# EAGLE design SeismoSpiesPCB (EAGLE 9.6.2)

## Sheet 1 of 2
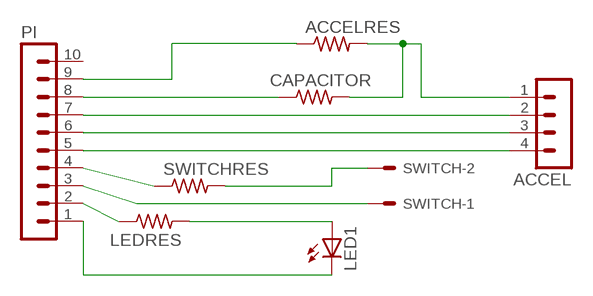
[diagram p0: schematic, sheet 1]

### Parts
ACCEL  04_PIN-HEADER  [MA04-1]
ACCELRES  4.7 K  RESISTOR0204/7  [RESISTOR]
CAPACITOR  RESISTOR0204/7  [RESISTOR]
LED1  LED3MM  [LED3MM]
LEDRES  RESISTOR0204/7  [RESISTOR]
PI  10_PIN-HEADER-(FROM_ARDUINO)  [MA10-1]
SWITCH  02_PIN-HEADER  [02_PIN]
SWITCHRES  RESISTOR0204/7  [RESISTOR]

### Nets
N$1: ACCEL.4 PI.5
N$2: PI.4 SWITCHRES.1
N$3: SWITCH.2 SWITCHRES.2
N$4: PI.3 SWITCH.1
N$5: LEDRES.1 PI.2
N$6: ACCEL.1 ACCELRES.2 CAPACITOR.2
N$7: ACCEL.3 PI.6
N$8: ACCELRES.1 PI.9
N$9: CAPACITOR.1 PI.8
N$10: ACCEL.2 PI.7
N$11: LED1.A LEDRES.2
N$12: LED1.K(C) PI.1
Unconnected: PI.10

## Sheet 2 of 2

## Library data of the parts
ACCEL = 1stYearEngineering:04_PIN-HEADER: PIN HEADER; OC_FARNELL: unknown; OC_NEWARK: unknown
ACCELRES CAPACITOR LEDRES SWITCHRES = 1stYearEngineering:RESISTOR: RESISTOR, American symbol
LED1 = 1stYearEngineering:LED: LED OSRAM: - CHIPLED LG R971, LG N971, LY N971, LG Q971, LY Q971, LO R971, LY R971 LH N974, LH R974 LS Q976, LO Q976, LY Q976 LO Q996 - Hyper CHIPLED LW Q18S LB Q993, LB Q99A, LB R99A - SideLED LS A670, LO A670, LY A670, LG A670, LP A670 LB A673, LV A673, LT A673, LW A673 LH A674 LY A675 LS A676, LA A676, LO A676, LY A676, LW A676 LS A679, LY A679, LG A679 - Hyper Micro SIDELED® LS Y876, LA Y876, LO Y876, LY Y876 LT Y87S - SmartLED LW L88C, LW L88S LB L89C, LB L89S, LG L890 LS L89K, LO L89K, LY L89K LS L896, LA L896, LO L896, LY L896 - TOPLED LS T670, LO T670, LY T670, LG T670, LP T670 LSG T670, LSP T670, LSY T670, LOP T670, LYG T670 LG T671, LOG T671, LSG T671 LB T673, LV T673, LT T673, LW T673 LH T674 LS T676, LA T676, LO T676, LY T676, LB T676, LH T676, LSB T676, LW T676 LB T67C, LV T67C, LT T67C, LS T67K, LO T67K, LY T67K, LW E67C LS E67B, LA E67B, LO E67B, LY E67B, LB E67C, LV E67C, LT E67C LW T67C LS T679, LY T679, LG T679 LS T770, LO T770, LY T770, LG T770, LP T770 LB T773, LV T773, LT T773, LW T773 LH T774 LS E675, LA E675, LY E675, LS T675 LS T776, LA T776, LO T776, LY T776, LB T776 LHGB T686 LT T68C, LB T68C - Hyper Mini TOPLED® LB M676 - Mini TOPLED Santana® LG M470 LS M47K, LO M47K, LY M47K Source: http://www.osram.convergy.de LUXEON: - LUMILED® LXK2-PW12-R00, LXK2-PW12-S00, LXK2-PW14-U00, LXK2-PW14-V00 LXK2-PM12-R00, LXK2-PM12-S00, LXK2-PM14-U00 LXK2-PE12-Q00, LXK2-PE12-R00, LXK2-PE12-S00, LXK2-PE14-T00, LXK2-PE14-U00 LXK2-PB12-K00, LXK2-PB12-L00, LXK2-PB12-M00, LXK2-PB14-N00, LXK2-PB14-P00, LXK2-PB14-Q00 LXK2-PR12-L00, LXK2-PR12-M00, LXK2-PR14-Q00, LXK2-PR14-R00 LXK2-PD12-Q00, LXK2-PD12-R00, LXK2-PD12-S00 LXK2-PH12-R00, LXK2-PH12-S00 LXK2-PL12-P00, LXK2-PL12-Q00, LXK2-PL12-R00 Source: www.luxeon.com KINGBRIGHT: KA-3528ASYC Source: www.kingbright.com
PI = 1stYearEngineering:10_PIN-HEADER-(FROM_ARDUINO): 10_PIN HEADER; OC_FARNELL: unknown; OC_NEWARK: unknown
SWITCH = 1stYearEngineering:02_PIN-HEADER: 2 Pin - 2mm Dual Row Source: www.mpe-connector.de / garry_shortform_2012.pdf

## Board
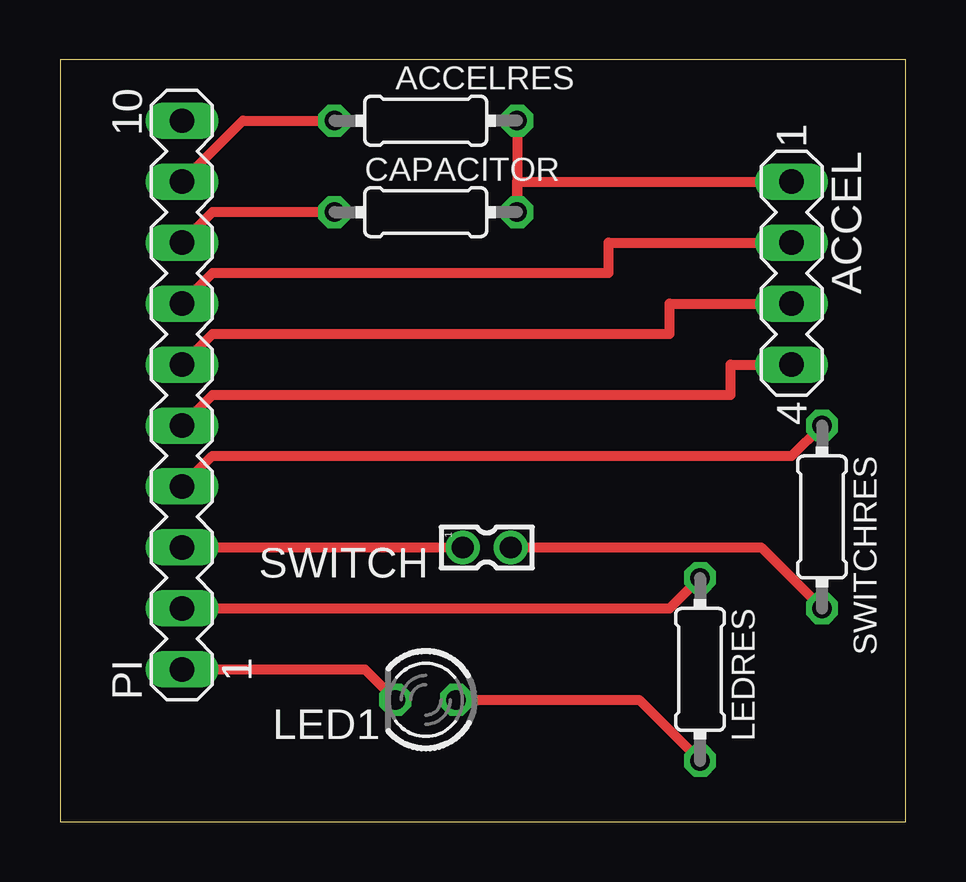
[diagram p1: board, top side]

Size 35.23 x 31.74 mm. Coordinates in mm from the lower left corner, seen from the top.
Outline: 0,0 35.23,0 35.23,31.74 0,31.74 0,0
Copper layers (1*16): Top 0.035mm / dielectric 1.5mm / Bottom 0.035mm
Design rules "default": minimum track width 6mil, minimum drill 0.35mm, track to track 6mil, track to pad 6mil, pad to pad 6mil, via to via 6mil, smd to smd 6mil, copper to edge 40mil, drill to drill 6mil, minimum pad ring 10mil, minimum via ring 8mil, stop-mask expansion 4mil, vias tented up to drill 0mil, thermal gap 10mil

### Footprints (pad centres in the part's own frame; a part is rotated, then mirrored left to right if it is on the bottom)
MA04-1 = drill 1.016 long: 1 -3.81,0; 2 -1.27,0; 3 1.27,0; 4 3.81,0
RESISTOR = drill 0.813 octagon: 1 -3.81,0; 2 3.81,0
LED3MM = drill 0.813 octagon: A -1.27,0; K 1.27,0
MA10-1 = drill 1.016 long: 1 -11.43,0; 2 -8.89,0; 3 -6.35,0; 4 -3.81,0; 5 -1.27,0; 6 1.27,0; 7 3.81,0; 8 6.35,0; 9 8.89,0; 10 11.43,0
02_PIN = drill 0.9 pad 1.27: 1 0,-1; 2 0,1

### Placement (x,y rotation side)
ACCEL  30.48,22.86 270 top
ACCELRES  15.24,29.21 0 top
CAPACITOR  15.24,25.4 0 top
LED1  15.24,5.08 180 top
LEDRES  26.67,6.35 270 top
PI  5.08,17.78 90 top
SWITCH  17.78,11.43 270 top
SWITCHRES  31.75,12.7 270 top

### Tracks (layer width: path | path; a pad name or v marks a point on that pad's centre or on a via)
N$1
  Top 0.406: PI.5 6.35,17.78 27.94,17.78 27.94,19.05 ACCEL.4
N$2
  Top 0.406: PI.4 6.35,15.24 30.48,15.24 SWITCHRES.1
N$3
  Top 0.406: SWITCH.2 29.21,11.43 SWITCHRES.2
N$4
  Top 0.406: PI.3 SWITCH.1
N$5
  Top 0.406: LEDRES.1 25.4,8.89 PI.2
N$6
  Top 0.406: ACCEL.1 19.05,26.67 CAPACITOR.2 ACCELRES.2
N$7
  Top 0.406: PI.6 6.35,20.32 25.4,20.32 25.4,21.59 ACCEL.3
N$8
  Top 0.406: PI.9 7.62,29.21 ACCELRES.1
N$9
  Top 0.406: CAPACITOR.1 6.35,25.4 PI.8
N$10
  Top 0.406: PI.7 6.35,22.86 22.86,22.86 22.86,24.13 ACCEL.2
N$11
  Top 0.406: LED1.A 24.13,5.08 LEDRES.2
N$12
  Top 0.406: PI.1 12.7,6.35 LED1.K